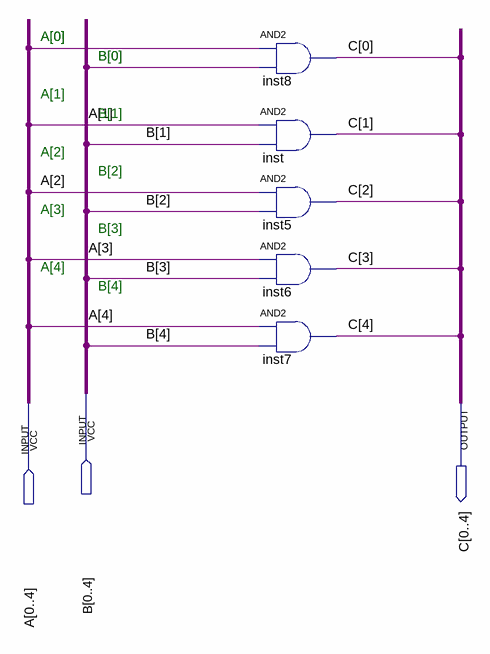
[diagram p0: schematic sheet]
// Quartus schematic e.bdf as structural Verilog: 5 symbols, 3 pins
module e (
  input  [0:4] B,
  input  [0:4] A,
  output [0:4] C
);

  and inst8 (C[0], A[0], B[0]);
  and inst (C[1], A[1], B[1]);
  and inst5 (C[2], A[2], B[2]);
  and inst6 (C[3], A[3], B[3]);
  and inst7 (C[4], A[4], B[4]);

  // Notes on the sheet:
  //   A[0]
  //   B[0]
  //   A[1]
  //   B[1]
  //   A[2]
  //   B[2]
  //   A[3]
  //   B[3]
  //   A[4]
  //   B[4]
endmodule
